# Altium schematic sheet ProximityDetector.SchDoc: Proximity Detector
size A4; Date: FS17; DrawnBy: M. Schwegler; Organization: HSLU T&A; Address1: Abteilung Elektrotechnik; Address2: Technikumsstrasse 21; Address3: CH-6048 Horw; Revision: v1; SheetNumber: 1; SheetTotal: 1; Projektname: SmartBoard; DocumentName: ProximityDetector
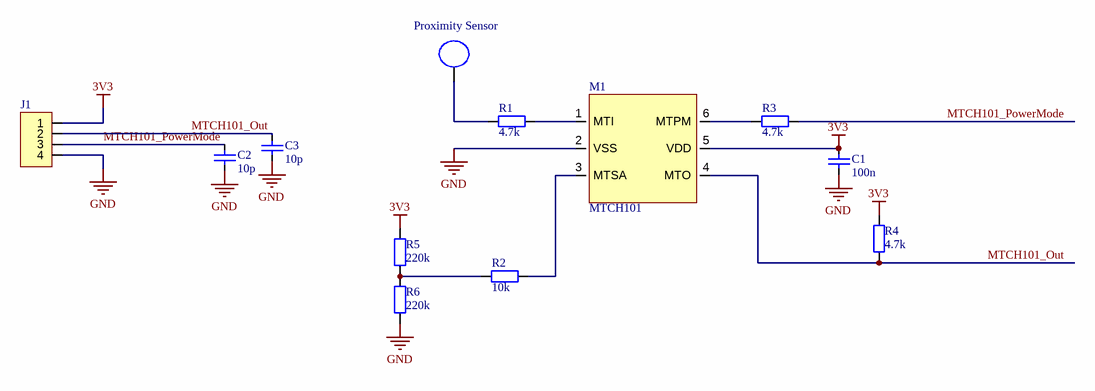
[diagram p0: ProximityDetector.SchDoc]

## Parts
C1  100n  [0805_C]
C2  10p  [0805_C]
C3  10p  [0805_C]
J1  (no value)  [CON_THT_4P_RM2.54]
M1  MTCH101  [SOT23-6]
Proximity_Sensor  Detector  [Hole_1.3mm]  (value not drawn)
R1  4.7k  [0805_R]
R2  10k  [0805_R]
R3  4.7k  [0805_R]
R4  4.7k  [0805_R]
R5  220k  [0805_R]
R6  220k  [0805_R]

## Nets
3V3: C1.2 J1.1 M1.5(VDD) R4.2 R5.2
GND: C1.1 C2.1 C3.1 J1.4 M1.2(VSS) R6.1
MTCH101_Out: C3.2 J1.2 M1.4(MTO) R4.1
MTCH101_PowerMode: C2.2 J1.3 R3.2
NetM1_1: M1.1(MTI) R1.2
NetM1_3: M1.3(MTSA) R2.2
NetM1_6: M1.6(MTPM) R3.1
NetProximity_Sensor_1: Proximity_Sensor.1 R1.1
NetR2_1: R2.1 R5.1 R6.2

## Notes on the sheet
- Project:
- Drawn by:
- Size:
- Sheet
- A4
- Rev.:
- of
- Date:
- File:

## Library data of the parts
C1-C3 = Cap
J1 = CON_4P
R1-R6 = Res